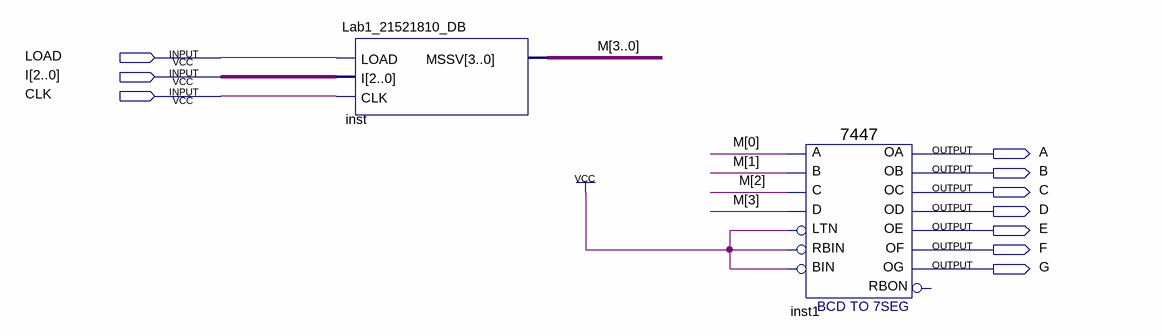
[diagram p0: schematic sheet]
// Quartus schematic KITD2.bdf as structural Verilog: 2 symbols, 10 pins
module KITD2 (
  input  LOAD,
  input  [2:0] I,
  input  CLK,
  output A,
  output B,
  output C,
  output D,
  output E,
  output F,
  output G
);

  wire [3:0] M;

  Lab1_21521810_DB inst (.LOAD(LOAD), .I(I), .CLK(CLK), .MSSV(M));
  \7447  inst1 (
    .LTN(1'b1), .B(M[1]), .C(M[2]), .D(M[3]), .RBIN(1'b1), .BIN(1'b1), .A(M[0]), .OB(B), .OC(C), .OE(E),
    .OD(D), .OF(F), .OG(G), .OA(A));  // open: RBON
endmodule
